# EAGLE design Sync Out - Arduino (EAGLE 9.6.2)
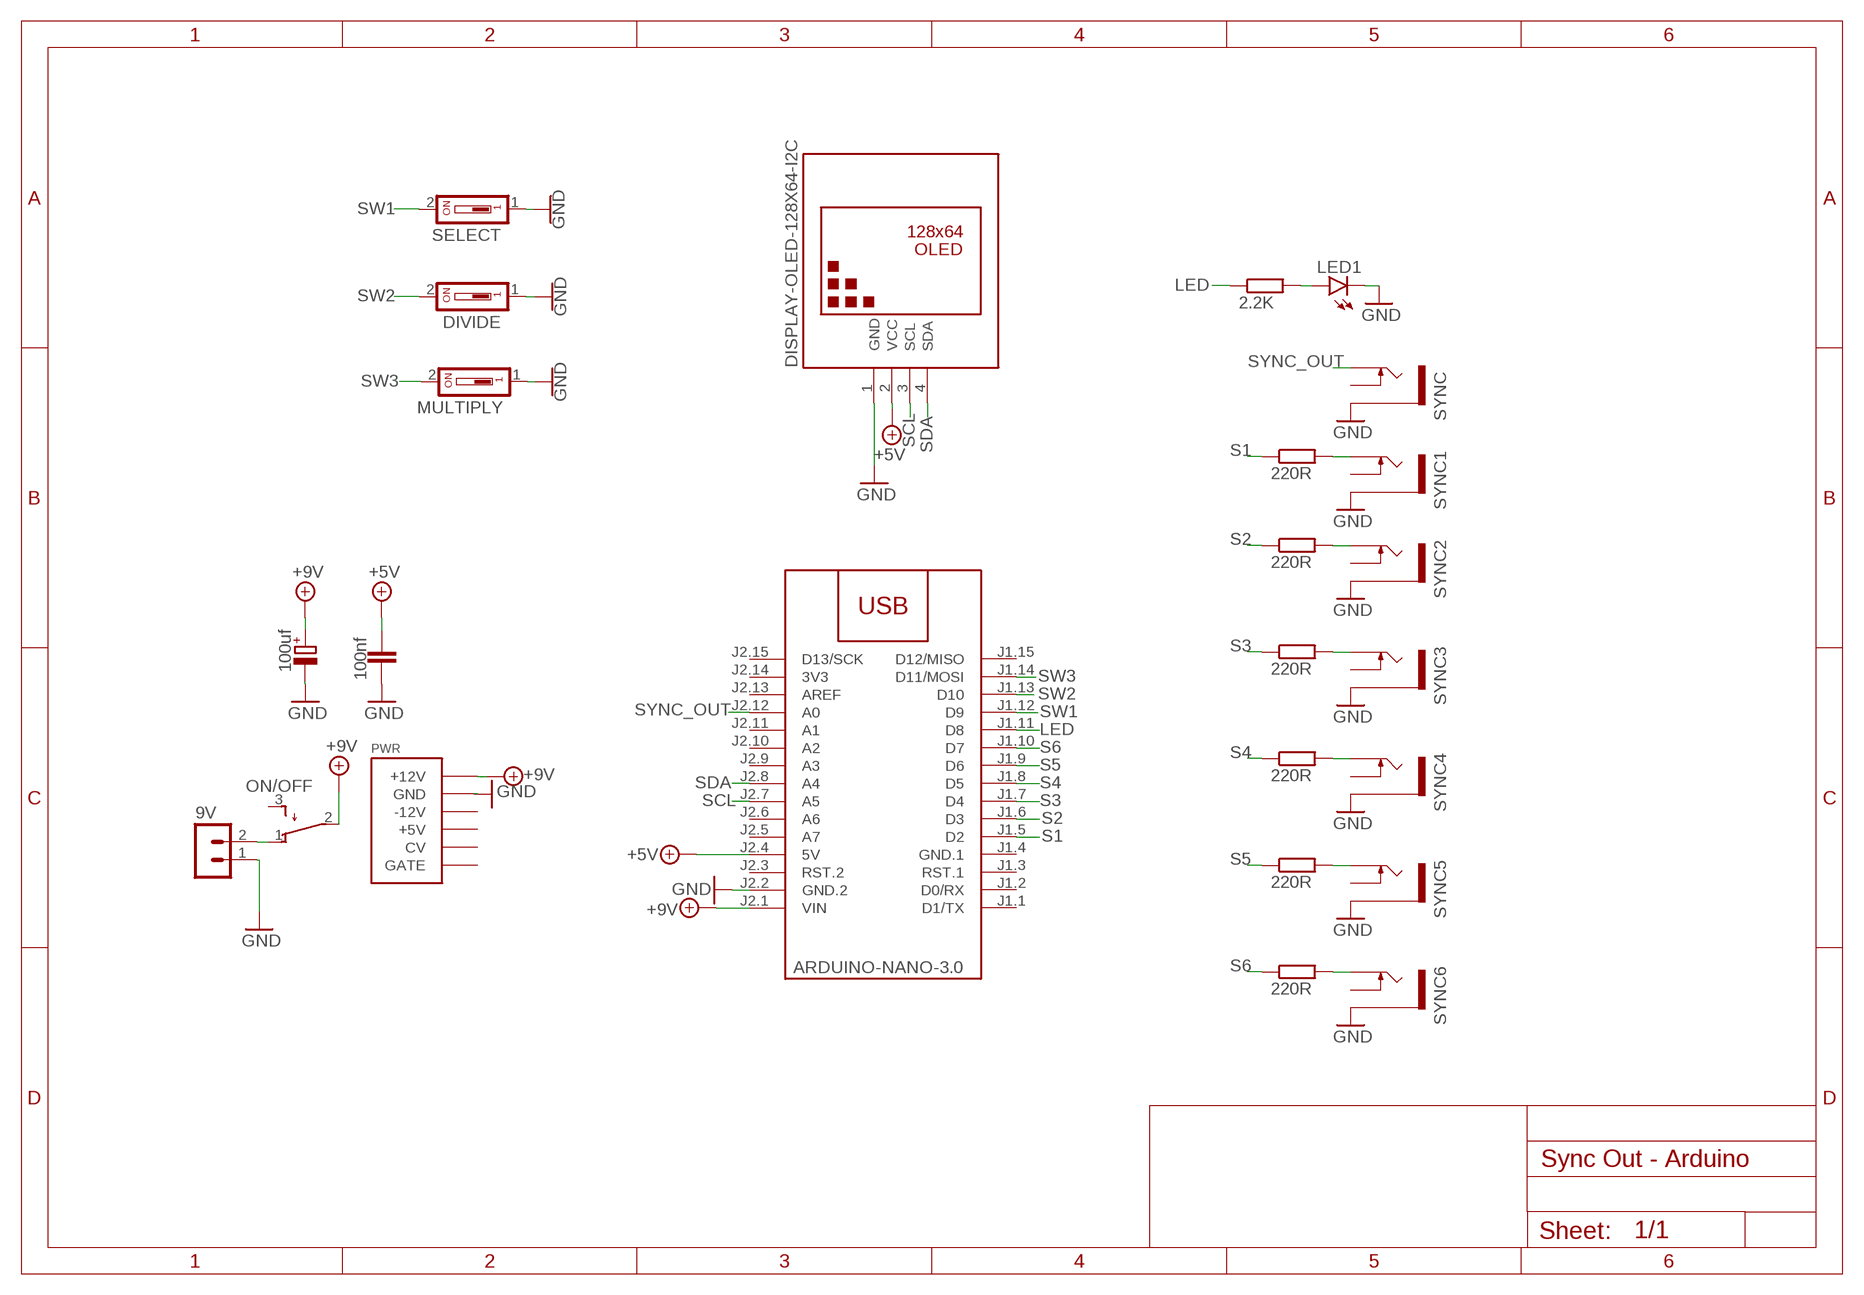
[diagram p0: schematic, sheet 1]

## Parts
9V  B2B-PH-K-S  [B2B-PH-K-S]
C1  100nf  C-EU050-024X044  [C050-024X044]
C3  100uf  CPOL-EUE2-5  [E2-5]
DIVIDE  DS01  [DS-01]
LED1  LED3MM  [LED3MM]
M1  ARDUINO-NANO-3.0  [ARDUINO-NANO-3.0]
MULTIPLY  DS01  [DS-01]
ON/OFF  TL32PO  [TL3XPO]
PWR  POWER  [POWER_16]
R1  220R  R-EU_0207/10  [0207/10]
R2  220R  R-EU_0207/10  [0207/10]
R3  220R  R-EU_0207/10  [0207/10]
R4  220R  R-EU_0207/10  [0207/10]
R5  220R  R-EU_0207/10  [0207/10]
R6  220R  R-EU_0207/10  [0207/10]
R7  2.2K  R-EU_0207/10  [0207/10]
SELECT  DS01  [DS-01]
SYNC  THONKICONNNEW  [WQP-PJ301M-12_JACK]
SYNC1  THONKICONNNEW  [WQP-PJ301M-12_JACK]
SYNC2  THONKICONNNEW  [WQP-PJ301M-12_JACK]
SYNC3  THONKICONNNEW  [WQP-PJ301M-12_JACK]
SYNC4  THONKICONNNEW  [WQP-PJ301M-12_JACK]
SYNC5  THONKICONNNEW  [WQP-PJ301M-12_JACK]
SYNC6  THONKICONNNEW  [WQP-PJ301M-12_JACK]
U$2  DISPLAY-OLED-128X64-I2C  [DISPLAY-OLED-128X64-I2C]

## Nets
+5V: C1.1 M1.J2.4(5V) U$2.2(VCC)
+9V: C3.+ M1.J2.1(VIN) ON/OFF.2(P) PWR.9(+12V) PWR.10(+12V)
GND: 9V.1 C1.2 C3.- DIVIDE.1 LED1.K(C) M1.J2.2(GND.2) MULTIPLY.1 PWR.3(GND) PWR.4(GND) PWR.5(GND) PWR.6(GND) PWR.7(GND) PWR.8(GND) SELECT.1 SYNC1.P$3_SLEEVE(SLEEVE) SYNC2.P$3_SLEEVE(SLEEVE) SYNC3.P$3_SLEEVE(SLEEVE) SYNC4.P$3_SLEEVE(SLEEVE) SYNC5.P$3_SLEEVE(SLEEVE) SYNC6.P$3_SLEEVE(SLEEVE) SYNC.P$3_SLEEVE(SLEEVE) U$2.1(GND)
LED: M1.J1.11(D8) R7.1
N$1: LED1.A R7.2
N$2: 9V.2 ON/OFF.1(O)
N$4: R1.2 SYNC1.P$1_TIP(TIP)
N$6: R2.2 SYNC2.P$1_TIP(TIP)
N$8: R3.2 SYNC3.P$1_TIP(TIP)
N$10: R4.2 SYNC4.P$1_TIP(TIP)
N$12: R5.2 SYNC5.P$1_TIP(TIP)
N$14: R6.2 SYNC6.P$1_TIP(TIP)
S1: M1.J1.5(D2) R1.1
S2: M1.J1.6(D3) R2.1
S3: M1.J1.7(D4) R3.1
S4: M1.J1.8(D5) R4.1
S5: M1.J1.9(D6) R5.1
S6: M1.J1.10(D7) R6.1
SCL: M1.J2.7(A5) U$2.3(SCL)
SDA: M1.J2.8(A4) U$2.4(SDA)
SW1: M1.J1.12(D9) SELECT.2
SW2: DIVIDE.2 M1.J1.13(D10)
SW3: M1.J1.14(D11/MOSI) MULTIPLY.2
SYNC_OUT: M1.J2.12(A0) SYNC.P$1_TIP(TIP)
Unconnected: M1.J1.1(D1/TX) M1.J1.2(D0/RX) M1.J1.3(RST.1) M1.J1.15(D12/MISO) M1.J2.3(RST.2) M1.J2.5(A7) M1.J2.6(A6) M1.J2.9(A3) M1.J2.10(A2) M1.J2.11(A1) M1.J2.13(AREF) M1.J2.15(D13/SCK) ON/OFF.3(S) PWR.1(-12V) PWR.2(-12V) PWR.11(+5V) PWR.12(+5V) PWR.13(CV) PWR.14(CV) PWR.15(GATE) PWR.16(GATE) SYNC1.P$2_SWITCH(SWITCH) SYNC2.P$2_SWITCH(SWITCH) SYNC3.P$2_SWITCH(SWITCH) SYNC4.P$2_SWITCH(SWITCH) SYNC5.P$2_SWITCH(SWITCH) SYNC6.P$2_SWITCH(SWITCH) SYNC.P$2_SWITCH(SWITCH)

## Power pins joined to a net without a drawn wire
3V3: M1.J2.14(3V3)
GND.1: M1.J1.4(GND.1)

## Library data of the parts
9V = con-JST PH:B2B-PH: JST PH series header 2.00mm pitch disconnectable crimp style connectors, vertical (side entry type), 2 pins
C1 = rcl:C-EU: CAPACITOR, European symbol; SPICEPREFIX: C
C3 = rcl:CPOL-EU: POLARIZED CAPACITOR, European symbol; SPICEPREFIX: C
DIVIDE MULTIPLY SELECT = 5mm SPST Switch:DS01: DIL/CODE SWITCH; OC_FARNELL: unknown; OC_NEWARK: unknown
LED1 = led:LED: LED OSRAM: - CHIPLED LG R971, LG N971, LY N971, LG Q971, LY Q971, LO R971, LY R971 LH N974, LH R974 LS Q976, LO Q976, LY Q976 LO Q996 - Hyper CHIPLED LW Q18S LB Q993, LB Q99A, LB R99A - SideLED LS A670, LO A670, LY A670, LG A670, LP A670 LB A673, LV A673, LT A673, LW A673 LH A674 LY A675 LS A676, LA A676, LO A676, LY A676, LW A676 LS A679, LY A679, LG A679 - Hyper Micro SIDELED® LS Y876, LA Y876, LO Y876, LY Y876 LT Y87S - SmartLED LW L88C, LW L88S LB L89C, LB L89S, LG L890 LS L89K, LO L89K, LY L89K LS L896, LA L896, LO L896, LY L896 - TOPLED LS T670, LO T670, LY T670, LG T670, LP T670 LSG T670, LSP T670, LSY T670, LOP T670, LYG T670 LG T671, LOG T671, LSG T671 LB T673, LV T673, LT T673, LW T673 LH T674 LS T676, LA T676, LO T676, LY T676, LB T676, LH T676, LSB T676, LW T676 LB T67C, LV T67C, LT T67C, LS T67K, LO T67K, LY T67K, LW E67C LS E67B, LA E67B, LO E67B, LY E67B, LB E67C, LV E67C, LT E67C LW T67C LS T679, LY T679, LG T679 LS T770, LO T770, LY T770, LG T770, LP T770 LB T773, LV T773, LT T773, LW T773 LH T774 LS E675, LA E675, LY E675, LS T675 LS T776, LA T776, LO T776, LY T776, LB T776 LHGB T686 LT T68C, LB T68C - Hyper Mini TOPLED® LB M676 - Mini TOPLED Santana® LG M470 LS M47K, LO M47K, LY M47K Source: http://www.osram.convergy.de LUXEON: - LUMILED® LXK2-PW12-R00, LXK2-PW12-S00, LXK2-PW14-U00, LXK2-PW14-V00 LXK2-PM12-R00, LXK2-PM12-S00, LXK2-PM14-U00 LXK2-PE12-Q00, LXK2-PE12-R00, LXK2-PE12-S00, LXK2-PE14-T00, LXK2-PE14-U00 LXK2-PB12-K00, LXK2-PB12-L00, LXK2-PB12-M00, LXK2-PB14-N00, LXK2-PB14-P00, LXK2-PB14-Q00 LXK2-PR12-L00, LXK2-PR12-M00, LXK2-PR14-Q00, LXK2-PR14-R00 LXK2-PD12-Q00, LXK2-PD12-R00, LXK2-PD12-S00 LXK2-PH12-R00, LXK2-PH12-S00 LXK2-PL12-P00, LXK2-PL12-Q00, LXK2-PL12-R00 Source: www.luxeon.com KINGBRIGHT: KA-3528ASYC Source: www.kingbright.com
M1 = diy-modules:ARDUINO-NANO-3.0: Arduino Nano 3.0 and compatible devices More details available here: https://www.arduino.cc/en/Main/ArduinoBoardNano Click here to find device on ebay.com <http://www.ebay.com/sch/arduino+nano>
ON/OFF = switch:TL32PO: TINY SWITCH ON - MOM Source: http://www2.produktinfo.conrad.com/datenblaetter/700000-724999/705152-da-01-de-Subminiaturschalter_TL_36YO.pdf
PWR = EurorackModularParts:POWER
R1-R7 = rcl:R-EU_: RESISTOR, European symbol; SPICEPREFIX: R
SYNC SYNC1-SYNC6 = MusicThingModular:THONKICONN: 3.5mm socket for Eurorack modular synths
U$2 = diy-modules:DISPLAY-OLED-128X64-I2C: 128x64 Dot Matrix OLED Module based on SSD1306 chip Variant with I2C interface More details available here: http://www.instructables.com/id/Monochrome-096-i2c-OLED-display-with-arduino-SSD13/ SSD1306 datasheet: https://cdn-shop.adafruit.com/datasheets/SSD1306.pdf Click here to find device on ebay.com <http://www.ebay.com/sch/oled+display+128x64+iic> Note: There are two variants: I2C and SPI. Search for the proper version.

## Board
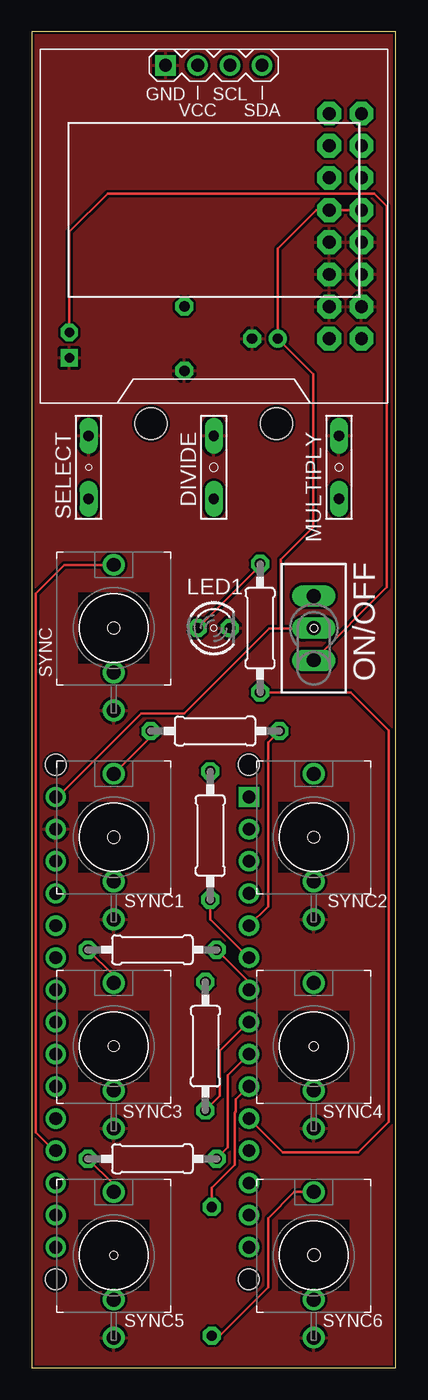
[diagram p1: board, top side]
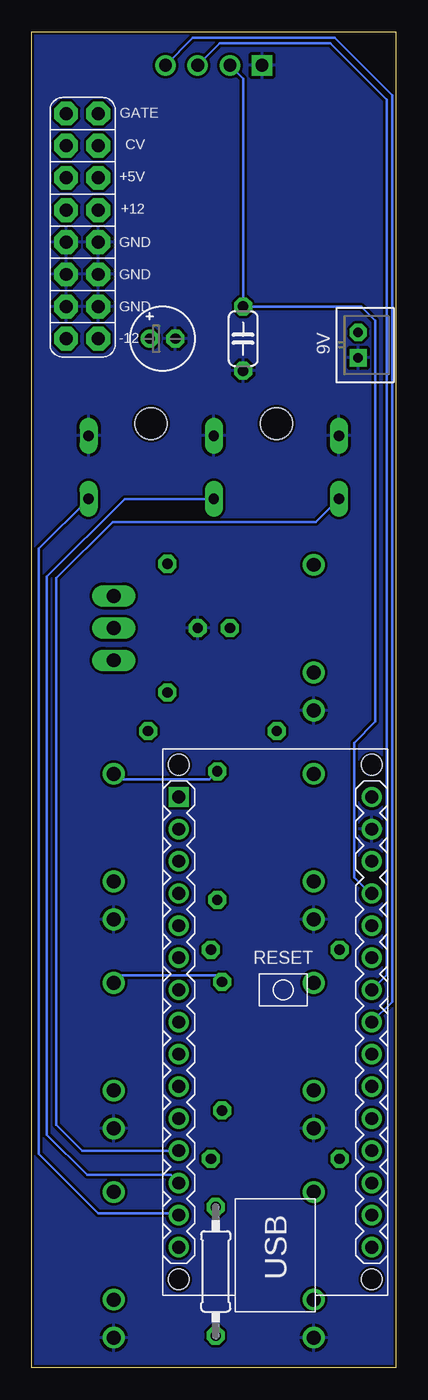
[diagram p2: board, bottom side, seen from below]

Size 28.75 x 105.53 mm. Coordinates in mm from the lower left corner, seen from the top.
Outline: 0,0 28.75,0 28.75,105.53 0,105.53 0,0
Copper layers (1*16): Top 0.035mm / dielectric 1.5mm / Bottom 0.035mm
Design rules "SparkFun": minimum track width 8mil, minimum drill 20mil, track to track 8mil, track to pad 8mil, pad to pad 8mil, via to via 8mil, smd to smd 8mil, copper to edge 8mil, drill to drill 8mil, minimum pad ring 12mil, minimum via ring 10mil, stop-mask expansion 4mil, vias tented up to drill 20mil, thermal gap 10mil
Holes 2.54 mm at 9.42,74.57 19.33,74.57

### Footprints (pad centres in the part's own frame; a part is rotated, then mirrored left to right if it is on the bottom)
B2B-PH-K-S = drill 0.75 pad 1.3 square: 1 1,0 | drill 0.75 pad 1.3 octagon: 2 -1,0
C050-024X044 = drill 0.813 octagon: 1 -2.54,0; 2 2.54,0
E2-5 = drill 0.813 pad 1.27: + -1.016,0 | drill 0.813 pad 1.27 octagon: - 1.016,0
DS-01 = drill 0.813 long: 1 2.489,0; 2 -2.489,0
LED3MM = drill 0.813 octagon: A -1.27,0; K 1.27,0
ARDUINO-NANO-3.0 = drill 1 square: J1.1 17.78,7.62 | drill 1: J1.2 15.24,7.62; J1.3 12.7,7.62; J1.4 10.16,7.62; J1.5 7.62,7.62; J1.6 5.08,7.62; J1.7 2.54,7.62; J1.8 0,7.62; J1.9 -2.54,7.62; J1.10 -5.08,7.62; J1.11 -7.62,7.62; J1.12 -10.16,7.62; J1.13 -12.7,7.62; J1.14 -15.24,7.62; J1.15 -17.78,7.62; J2.1 17.78,-7.62; J2.2 15.24,-7.62; J2.3 12.7,-7.62; J2.4 10.16,-7.62; J2.5 7.62,-7.62; J2.6 5.08,-7.62; J2.7 2.54,-7.62; J2.8 0,-7.62; J2.9 -2.54,-7.62; J2.10 -5.08,-7.62; J2.11 -7.62,-7.62; J2.12 -10.16,-7.62; J2.13 -12.7,-7.62; J2.14 -15.24,-7.62; J2.15 -17.78,-7.62 | hole 1.651: -20.32,7.62; -20.32,-7.62; 20.32,-7.62; 20.32,7.62
TL3XPO = drill 1.1 pad 1.422 long: 1 -2.54,0; 2 0,0; 3 2.54,0
POWER_16 = drill 1.016 pad 1.88 octagon: 1 -8.89,-1.27; 2 -8.89,1.27; 3 -6.35,-1.27; 4 -6.35,1.27; 5 -3.81,-1.27; 6 -3.81,1.27; 7 -1.27,-1.27; 8 -1.27,1.27; 9 1.27,-1.27; 10 1.27,1.27; 11 3.81,-1.27; 12 3.81,1.27; 13 6.35,-1.27; 14 6.35,1.27; 15 8.89,-1.27; 16 8.89,1.27
0207/10 = drill 0.813 octagon: 1 -5.08,0; 2 5.08,0
WQP-PJ301M-12_JACK = drill 1.1: P$1_TIP 0,5; P$2_SWITCH 0,-3.5; P$3_SLEEVE 0,-6.5
DISPLAY-OLED-128X64-I2C = drill 1 square: 1 -3.81,12.7 | drill 1: 2 -1.27,12.7; 3 1.27,12.7; 4 3.81,12.7

### Placement (x,y rotation side)
9V  2.97,80.77 270 bottom
C1  12.06,81.28 270 bottom
C3  18.41,81.28 0 bottom
DIVIDE  14.38,71.12 90 top
LED1  14.38,58.42 0 top
M1  9.53,27.3 90 bottom
MULTIPLY  24.26,71.12 90 top
ON/OFF  22.28,58.42 90 top
PWR  24.76,90.17 90 bottom
R1  14.48,50.29 180 top
R2  14.1,42.04 90 top
R3  9.53,33.02 180 top
R4  13.72,25.4 90 top
R5  9.53,16.51 180 top
R6  14.22,7.62 270 bottom
R7  18.03,58.42 90 top
SELECT  4.5,71.12 90 top
SYNC  6.48,58.42 0 top
SYNC1  6.48,41.91 0 top
SYNC2  22.28,41.91 0 top
SYNC3  6.48,25.4 0 top
SYNC4  22.28,25.4 0 top
SYNC5  6.48,8.89 0 top
SYNC6  22.28,8.89 0 top
U$2  14.38,90.17 0 top

### Tracks (layer width: path | path; a pad name or v marks a point on that pad's centre or on a via)
+5V
  Bottom 0.203: M1.J2.4 2.03,37.47 3.3,38.73 3.3,49.35 1.63,51.03 1.63,82.7 2.74,83.82 C1.1 12.06,101.83 U$2.2
+9V
  Top 0.203: M1.J2.1 2.04,45.09 8.65,51.69 12.06,51.69 18.77,58.4 19.66,58.4 | PWR.10 PWR.9 22.48,91.44 19.43,88.39 C3.+ 22.22,78.49 22.22,66.4 19.66,63.83 19.66,58.4 | ON/OFF.2 22.25,58.4 19.66,58.4
GND
  pour Top: 0,105.41 28.83,105.41 28.83,0 0,0
  pour Bottom: 0,105.41 28.83,105.41 28.83,0 0,0
LED
  Top 0.203: M1.J1.11 19.81,17.02 25.78,17.02 28.19,19.43 28.19,50.32 25.17,53.34 R7.1
N$1
  Top 0.203: R7.2 18.03,63.35 LED1.A
N$2
  Top 0.203: ON/OFF.1 28.04,61.65 28.04,91.75 27.05,92.73 5.99,92.73 2.97,89.71 9V.2
N$4
  Top 0.203: SYNC1.P$1_TIP 9.4,49.83 R1.2
N$6
  Bottom 0.203: R2.2 14.73,46.48 22.28,46.48 SYNC2.P$1_TIP
N$8
  Top 0.203: R3.2 6.48,30.99 SYNC3.P$1_TIP
N$10
  Bottom 0.203: R4.2 14.22,30.99 21.69,30.99 SYNC4.P$1_TIP
N$12
  Top 0.203: R5.2 6.48,14.48 SYNC5.P$1_TIP
N$14
  Top 0.203: SYNC6.P$1_TIP 20.75,13.89 18.67,11.81 18.67,6.35 14.86,2.54 R6.2
S1
  Top 0.203: M1.J1.5 18.67,36.45 18.67,49.4 R1.1
S2
  Top 0.203: M1.J1.6 14.1,35.43 R2.1
S3
  Top 0.203: R3.1 17.14,30.48 M1.J1.7
S4
  Top 0.203: R4.1 14.86,21.46 14.86,25.02 M1.J1.8
S5
  Top 0.203: R5.1 15.49,17.4 15.49,23.11 M1.J1.9
S6
  Top 0.203: R6.1 14.22,14.22 16.04,16.04 16.04,20.14 16.13,20.24 16.13,21.21 M1.J1.10
SCL
  Bottom 0.203: M1.J2.7 0.71,31.04 0.71,100.15 5.18,104.62 13.89,104.62 U$2.3
SDA
  Bottom 0.203: M1.J2.8 0.3,28.91 0.3,100.51 4.83,105.03 16.03,105.03 U$2.4
SW1
  Bottom 0.203: SELECT.2 6.33,66.8 22.35,66.8 26.8,62.36 26.8,19.18 24.76,17.14 M1.J1.12
SW2
  Bottom 0.203: M1.J1.13 17.78,15.24 24.38,15.24 27.56,18.41 27.56,62.48 21.41,68.63 DIVIDE.2
SW3
  Bottom 0.203: MULTIPLY.2 28.19,64.69 28.19,16.89 23.49,12.19 17.27,12.19 M1.J1.14
SYNC_OUT
  Top 0.203: M1.J2.12 1.76,17.14 0.3,18.61 0.3,51.21 0.3,61.14 2.59,63.42 SYNC.P$1_TIP